# Altium schematic sheet 3_ADSTM32_Peripheral.SchDoc
size A; SheetNumber: 4; SheetTotal: 4
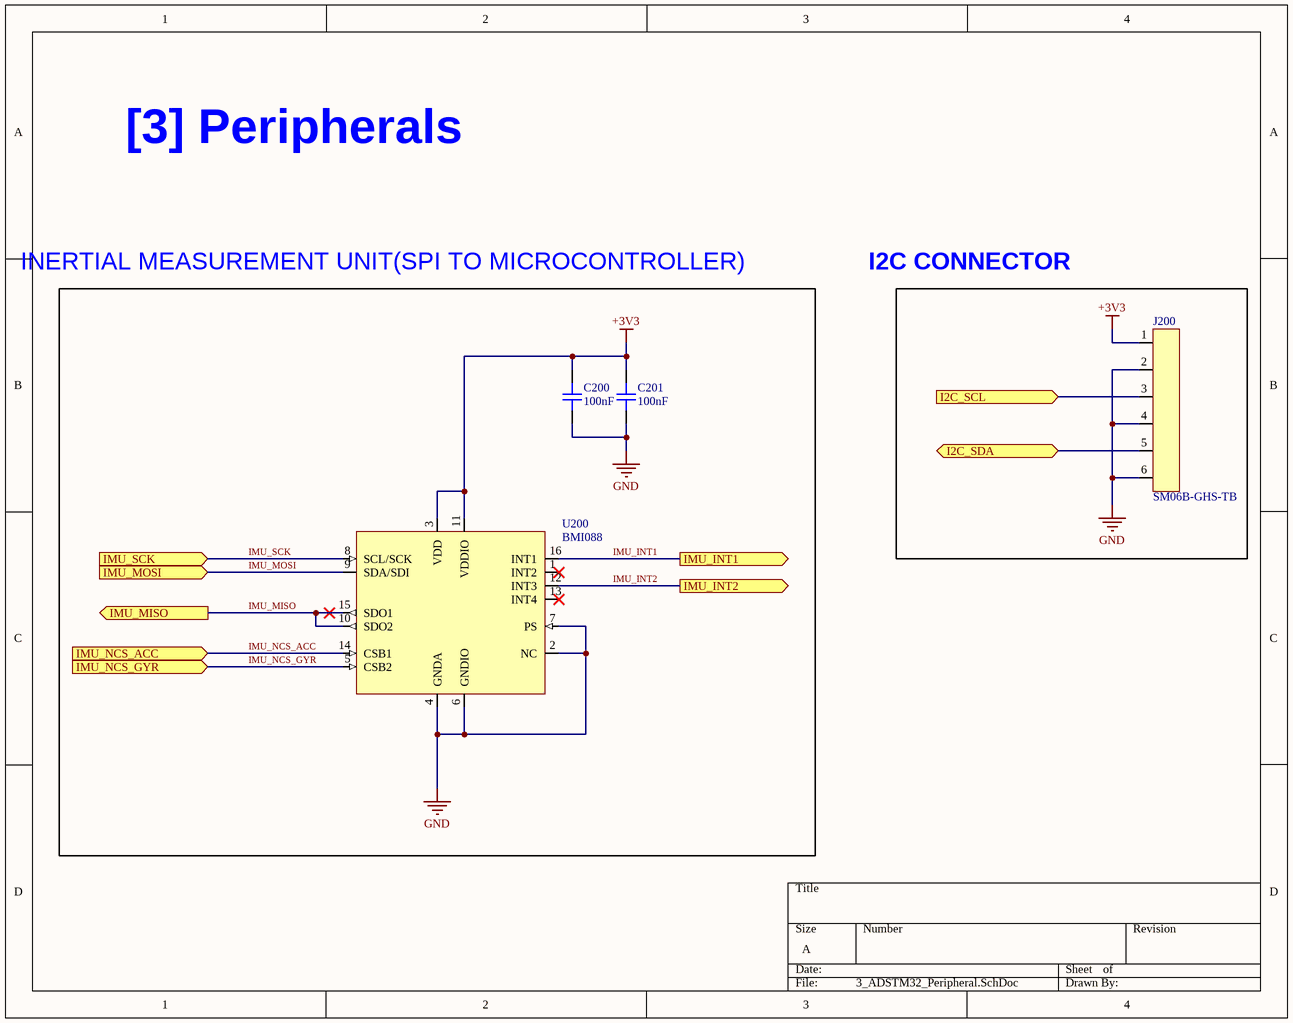
[diagram p0: 3_ADSTM32_Peripheral.SchDoc]

## Parts
C200  100nF  [CAP_0603]
C201  100nF  [CAP_0603]
J200  SM06B-GHS-TB  [SM06B-GHS-TB]
U200  BMI088  [BMI088]

## Ports
I2C_SCL (in, see 0_ADSTM32_Overview[3C], 2_ADSTM32_MCU[3A]), I2C_SDA (bidir, see 0_ADSTM32_Overview[3B], 2_ADSTM32_MCU[3B]), IMU_INT1 (out, see 0_ADSTM32_Overview[3B], 2_ADSTM32_MCU[3A]), IMU_INT2 (out, see 0_ADSTM32_Overview[3B], 2_ADSTM32_MCU[3A]), IMU_MISO (out, see 0_ADSTM32_Overview[3B], 2_ADSTM32_MCU[1B]), IMU_MOSI (in, see 0_ADSTM32_Overview[3B], 2_ADSTM32_MCU[1B]), IMU_NCS_ACC (in, see 0_ADSTM32_Overview[3B], 2_ADSTM32_MCU[1A]), IMU_NCS_GYR (in, see 0_ADSTM32_Overview[3B], 2_ADSTM32_MCU[1A]), IMU_SCK (in, see 0_ADSTM32_Overview[3B], 2_ADSTM32_MCU[1A])

## Nets
+3V3: C200.2 C201.2 J200.1 U200.3(VDD) U200.11(VDDIO)
GND: C200.1 C201.1 J200.2 J200.4 J200.6 U200.2(NC) U200.4(GNDA) U200.6(GNDIO) U200.7(PS)
I2C_SCL: J200.3 ; port I2C_SCL
I2C_SDA: J200.5 ; port I2C_SDA
IMU_INT1: U200.16(INT1) ; port IMU_INT1
IMU_INT2: U200.12(INT3) ; port IMU_INT2
IMU_MISO: U200.10(SDO2) U200.15(SDO1) ; port IMU_MISO
IMU_MOSI: U200.9(SDA/SDI) ; port IMU_MOSI
IMU_NCS_ACC: U200.14(CSB1) ; port IMU_NCS_ACC
IMU_NCS_GYR: U200.5(CSB2) ; port IMU_NCS_GYR
IMU_SCK: U200.8(SCL/SCK) ; port IMU_SCK

Not connected (* = marked no-connect by the designer): U200 1(INT2)* 13(INT4)*

## Notes on the sheet
- [3] Peripherals
- INERTIAL MEASUREMENT UNIT(SPI TO MICROCONTROLLER)
- I2C CONNECTOR

## Library data of the parts
C200 C201 = CAP_0603_16V: Capacitor SMD 0603 16V
J200 = SM06B-GHS-TB: Header Connector 6 Position 1.25MM Pitch SMD Horizontal JST GH; Manufacturer: JST; Manufacturer Part Number: SM06B-GHS-TB
U200 = BMI088: Inertial Measurement Unit IMU 6-Axis LGA; Manufacturer: Bosch; Manufacturer Part Number: BMI088